# Altium schematic sheet Sheet1.SchDoc
size A4; SheetNumber: 1; SheetTotal: 1
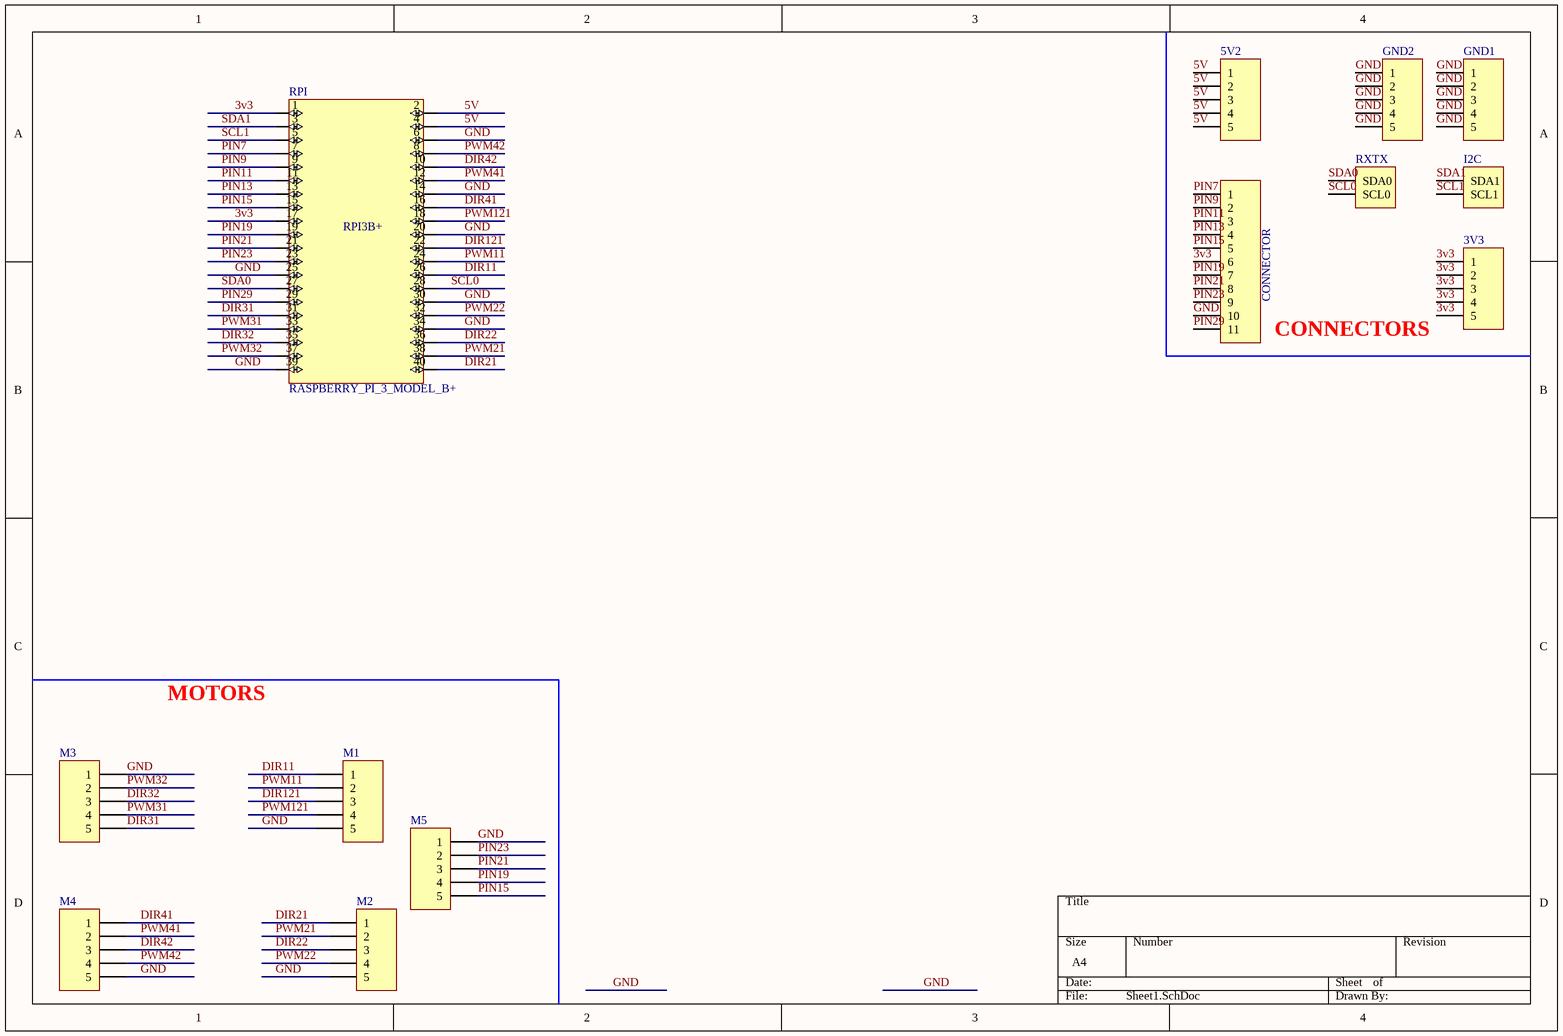
[diagram p0: Sheet1.SchDoc]

## Parts
3V3  Header 5  [HDR1X5]  (value not drawn)
5V2  Header 5  [HDR1X5]  (value not drawn)
CONNECTOR  Header 11  [HDR1X11]  (value not drawn)
GND1  Header 5  [HDR1X5]  (value not drawn)
GND2  Header 5  [HDR1X5]  (value not drawn)
I2C  Header 2  [HDR1X2]  (value not drawn)
M1  Header 5  [HDR1X5]  (value not drawn)
M2  Header 5  [HDR1X5]  (value not drawn)
M3  Header 5  [HDR1X5]  (value not drawn)
M4  Header 5  [HDR1X5]  (value not drawn)
M5  Header 5  [HDR1X5]  (value not drawn)
RPI  RASPBERRY_PI_3_MODEL_B+  [MODULE_RASPBERRY_PI_3_MODEL_B+]
RXTX  Header 2  [HDR1X2]  (value not drawn)

## Nets
3v3: 3V3.1 3V3.2 3V3.3 3V3.4 3V3.5 CONNECTOR.6 RPI.1 RPI.17
5V: 5V2.1 5V2.2 5V2.3 5V2.4 5V2.5 RPI.2 RPI.4
DIR11: M1.1 RPI.26
DIR21: M2.1 RPI.40
DIR22: M2.3 RPI.36
DIR31: M3.5 RPI.31
DIR32: M3.3 RPI.35
DIR41: M4.1 RPI.16
DIR42: M4.3 RPI.10
DIR121: M1.3 RPI.22
GND: CONNECTOR.10 GND1.1 GND1.2 GND1.3 GND1.4 GND1.5 GND2.1 GND2.2 GND2.3 GND2.4 GND2.5 M1.5 M2.5 M3.1 M4.5 M5.1 RPI.6 RPI.14 RPI.20 RPI.25 RPI.30 RPI.34 RPI.39
PIN7: CONNECTOR.1 RPI.7
PIN9: CONNECTOR.2 RPI.9
PIN11: CONNECTOR.3 RPI.11
PIN13: CONNECTOR.4 RPI.13
PIN15: CONNECTOR.5 M5.5 RPI.15
PIN19: CONNECTOR.7 M5.4 RPI.19
PIN21: CONNECTOR.8 M5.3 RPI.21
PIN23: CONNECTOR.9 M5.2 RPI.23
PIN29: CONNECTOR.11 RPI.29
PWM11: M1.2 RPI.24
PWM21: M2.2 RPI.38
PWM22: M2.4 RPI.32
PWM31: M3.4 RPI.33
PWM32: M3.2 RPI.37
PWM41: M4.2 RPI.12
PWM42: M4.4 RPI.8
PWM121: M1.4 RPI.18
SCL0: RPI.28 RXTX.2(SCL0)
SCL1: I2C.2(SCL1) RPI.5
SDA0: RPI.27 RXTX.1(SDA0)
SDA1: I2C.1(SDA1) RPI.3

## Notes on the sheet
- CONNECTORS
- MOTORS
- (in symbol RASPBERRY_PI_3_MODEL_B+) RPI3B+

## Library data of the parts
3V3 5V2 GND1 GND2 M1-M5 = Header 5: Header, 5-Pin; LatestRevisionDate: 17-Jul-2002; LatestRevisionNote: Re-released for DXP Platform.; Publisher: Altium Limited
CONNECTOR = Header 11: Header, 11-Pin; LatestRevisionDate: 17-Jul-2002; LatestRevisionNote: Re-released for DXP Platform.; Publisher: Altium Limited
I2C RXTX = Header 2: Header, 2-Pin; LatestRevisionDate: 17-Jul-2002; LatestRevisionNote: Re-released for DXP Platform.; Publisher: Altium Limited
RPI = RASPBERRY_PI_3_MODEL_B+: Case Plastic, ABS Black Hand Held, Split Sides 3.520 L x 2.740 W (89.41mm x 69.60mm) X 0.980 (24.89mm); MF: Raspberry Pi; MP: RASPBERRY PI 3 MODEL B+; Purchase-URL: https://pricing.snapeda.com/search/part/RASPBERRY PI 3 MODEL B+/?ref=eda; Check_prices: https://www.snapeda.com/parts/RASPBERRY%20PI%203%20MODEL%20B+/Raspberry+Pi/view-part/?ref=eda; SnapEDA_Link: https://www.snapeda.com/parts/RASPBERRY%20PI%203%20MODEL%20B+/Raspberry+Pi/view-part/?ref=snap; Price: None; Availability: In Stock; Package: Raspberry Pi; Value: *